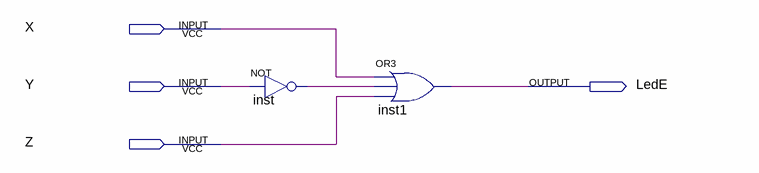
[diagram p0: schematic sheet]
// Quartus schematic LEDe.bdf as structural Verilog: 2 symbols, 4 pins
module LEDe (
  input  X,
  input  Y,
  input  Z,
  output LedE
);

  wire inst_out;

  not inst (inst_out, Y);
  or inst1 (LedE, X, inst_out, Z);
endmodule
